# EAGLE design miniframeV2 (EAGLE 5.10)
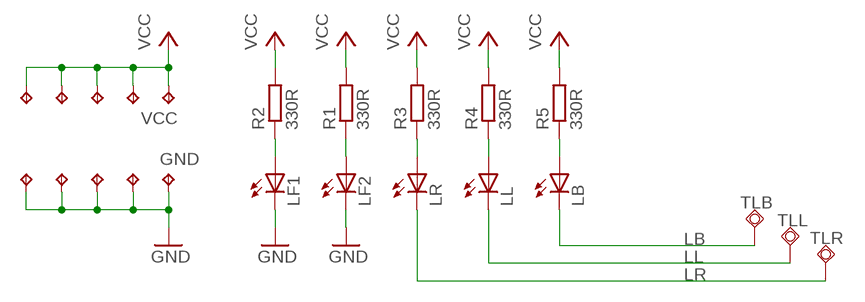
[diagram p0: schematic, sheet 1]

## Parts
GND  TPTP20SQ  [TP20SQ]
GND4  TPTP20SQ  [TP20SQ]
GND5  TPTP20SQ  [TP20SQ]
GND6  TPTP20SQ  [TP20SQ]
GND7  TPTP20SQ  [TP20SQ]
LB  LEDCHIPLED_1206  [CHIPLED_1206]
LF1  LEDCHIPLED_1206  [CHIPLED_1206]
LF2  LEDCHIPLED_1206  [CHIPLED_1206]
LL  LEDCHIPLED_1206  [CHIPLED_1206]
LR  LEDCHIPLED_1206  [CHIPLED_1206]
R1  330R  R-EU_R0805  [R0805]
R2  330R  R-EU_R0805  [R0805]
R3  330R  R-EU_R0805  [R0805]
R4  330R  R-EU_R0805  [R0805]
R5  330R  R-EU_R0805  [R0805]
TLB  TPSQTP19R  [TP19R]
TLL  TPSQTP19R  [TP19R]
TLR  TPSQTP19R  [TP19R]
VCC  TPTP20SQ  [TP20SQ]
VCC1  TPTP20SQ  [TP20SQ]
VCC2  TPTP20SQ  [TP20SQ]
VCC3  TPTP20SQ  [TP20SQ]
VCC4  TPTP20SQ  [TP20SQ]

## Nets
GND: GND4.TP GND5.TP GND6.TP GND7.TP GND.TP LF1.C LF2.C
LB: LB.C TLB.TP
LL: LL.C TLL.TP
LR: LR.C TLR.TP
N$1: LF1.A R2.1
N$2: LF2.A R1.1
N$3: LR.A R3.1
N$4: LL.A R4.1
N$5: LB.A R5.1
VCC: R1.2 R2.2 R3.2 R4.2 R5.2 VCC1.TP VCC2.TP VCC3.TP VCC4.TP VCC.TP

## Library data of the parts
GND GND4-GND7 VCC VCC1-VCC4 = testpad:TP: Test pad
LB LF1 LF2 LL LR = led:LED: LED OSRAM: - CHIPLED LG R971, LG N971, LY N971, LG Q971, LY Q971, LO R971, LY R971 LH N974, LH R974 LS Q976, LO Q976, LY Q976 LO Q996 - Hyper CHIPLED LW Q18S LB Q993, LB Q99A, LB R99A - SideLED LS A670, LO A670, LY A670, LG A670, LP A670 LB A673, LV A673, LT A673, LW A673 LH A674 LY A675 LS A676, LA A676, LO A676, LY A676, LW A676 LS A679, LY A679, LG A679 - Hyper Micro SIDELED® LS Y876, LA Y876, LO Y876, LY Y876 LT Y87S - SmartLED LW L88C, LW L88S LB L89C, LB L89S, LG L890 LS L89K, LO L89K, LY L89K LS L896, LA L896, LO L896, LY L896 - TOPLED LS T670, LO T670, LY T670, LG T670, LP T670 LSG T670, LSP T670, LSY T670, LOP T670, LYG T670 LG T671, LOG T671, LSG T671 LB T673, LV T673, LT T673, LW T673 LH T674 LS T676, LA T676, LO T676, LY T676, LB T676, LH T676, LSB T676, LW T676 LB T67C, LV T67C, LT T67C, LS T67K, LO T67K, LY T67K, LW E67C LS E67B, LA E67B, LO E67B, LY E67B, LB E67C, LV E67C, LT E67C LW T67C LS T679, LY T679, LG T679 LS T770, LO T770, LY T770, LG T770, LP T770 LB T773, LV T773, LT T773, LW T773 LH T774 LS E675, LA E675, LY E675, LS T675 LS T776, LA T776, LO T776, LY T776, LB T776 LHGB T686 LT T68C, LB T68C - Hyper Mini TOPLED® LB M676 - Mini TOPLED Santana® LG M470 LS M47K, LO M47K, LY M47K Source: http://www.osram.convergy.de LUXEON: - LUMILED® LXK2-PW12-R00, LXK2-PW12-S00, LXK2-PW14-U00, LXK2-PW14-V00 LXK2-PM12-R00, LXK2-PM12-S00, LXK2-PM14-U00 LXK2-PE12-Q00, LXK2-PE12-R00, LXK2-PE12-S00, LXK2-PE14-T00, LXK2-PE14-U00 LXK2-PB12-K00, LXK2-PB12-L00, LXK2-PB12-M00, LXK2-PB14-N00, LXK2-PB14-P00, LXK2-PB14-Q00 LXK2-PR12-L00, LXK2-PR12-M00, LXK2-PR14-Q00, LXK2-PR14-R00 LXK2-PD12-Q00, LXK2-PD12-R00, LXK2-PD12-S00 LXK2-PH12-R00, LXK2-PH12-S00 LXK2-PL12-P00, LXK2-PL12-Q00, LXK2-PL12-R00 Source: www.luxeon.com KINGBRIGHT: KA-3528ASYC Source: www.kingbright.com
R1-R5 = rcl:R-EU_: RESISTOR, European symbol
TLB TLL TLR = testpad:TPSQ: Test pad

## Board
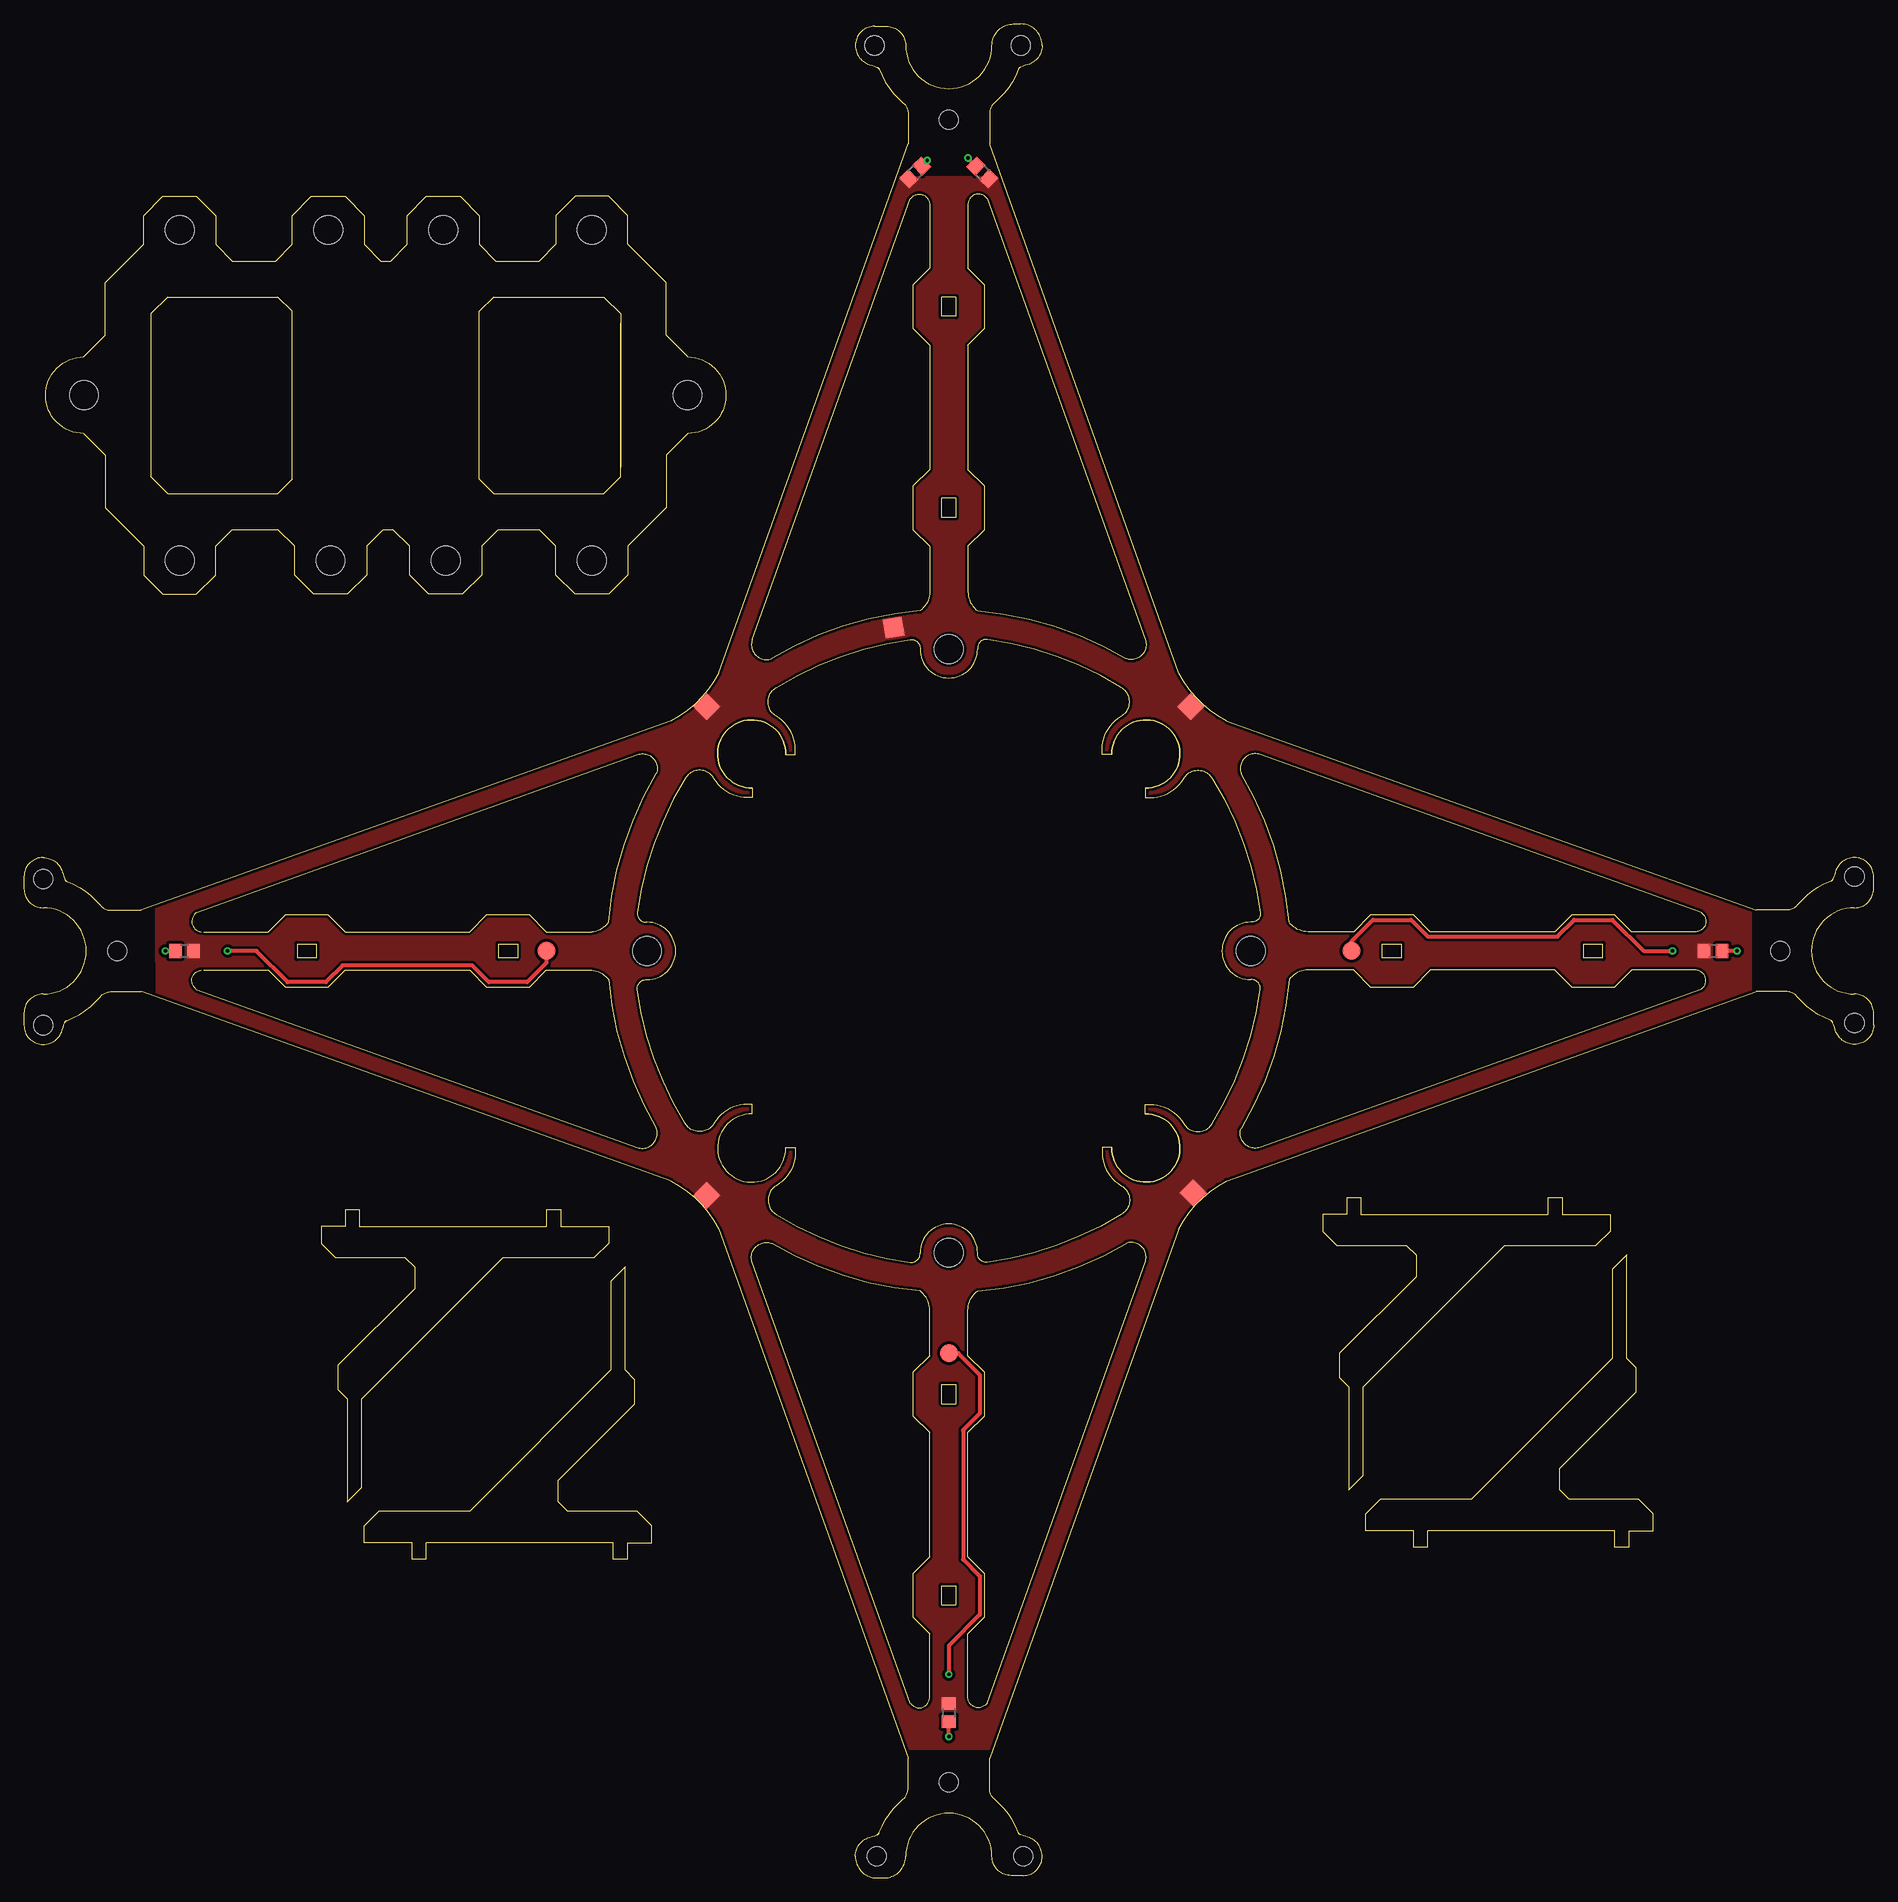
[diagram p1: board, top side]
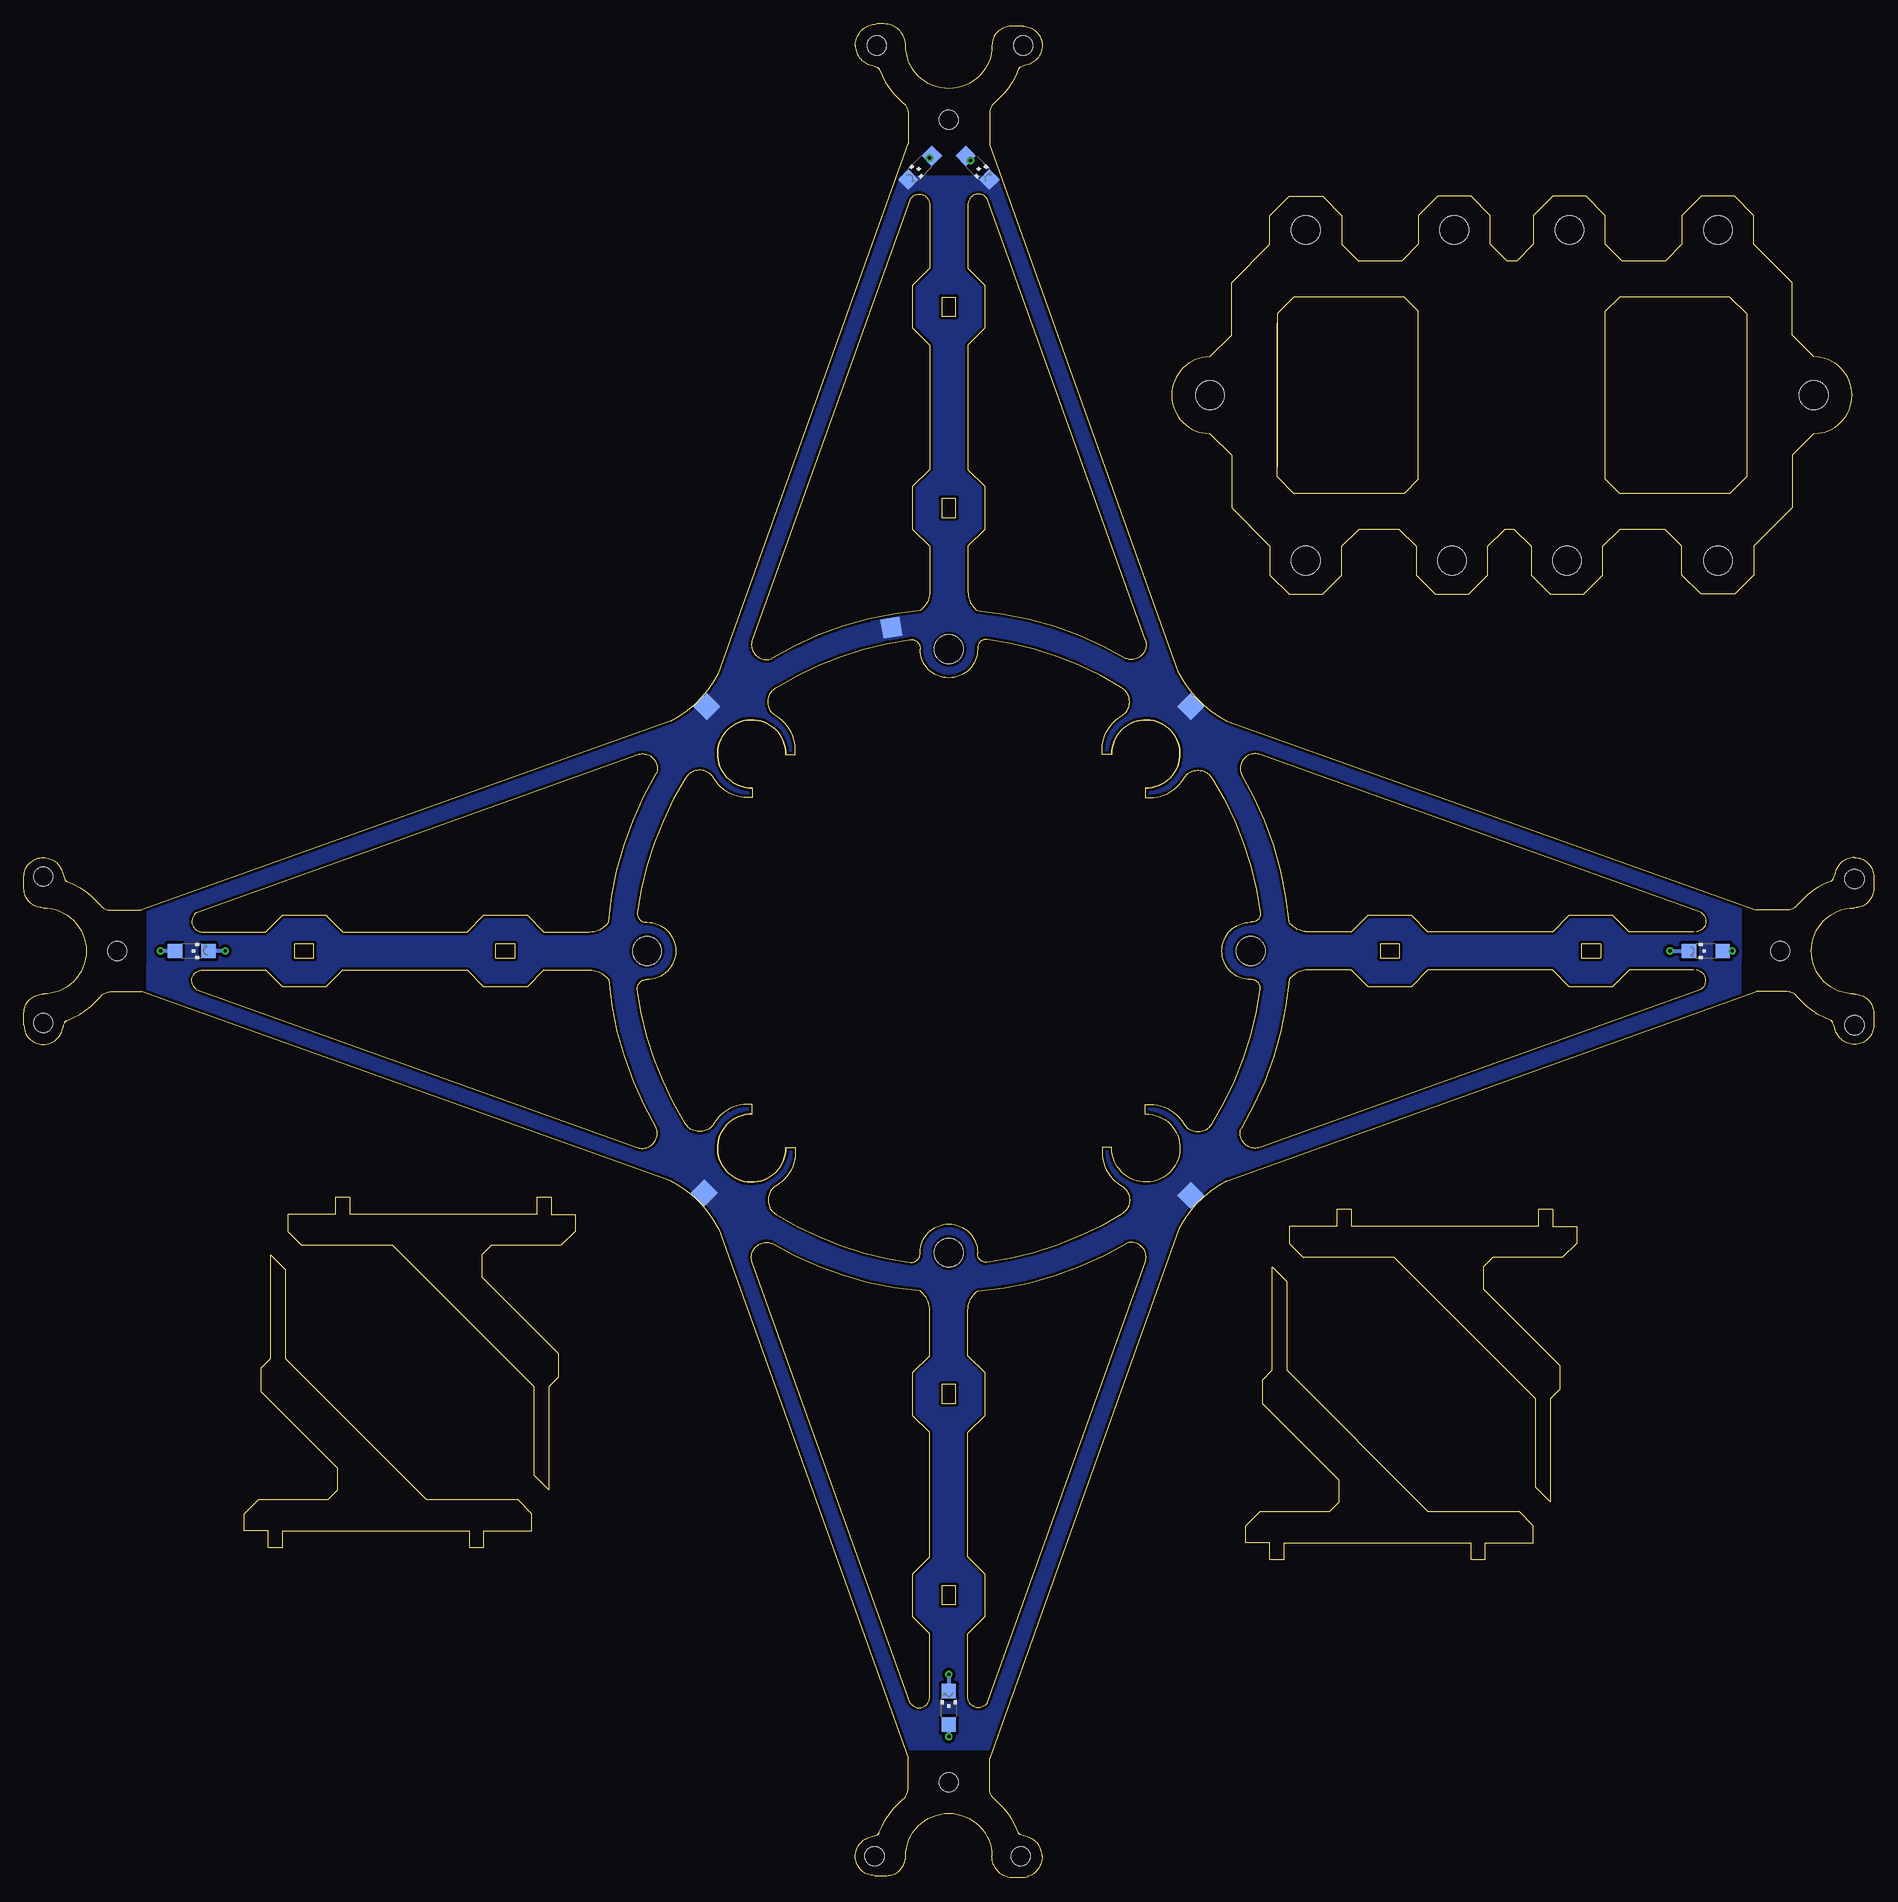
[diagram p2: board, bottom side, seen from below]

Size 193 x 193.5 mm. Coordinates in mm from the lower left corner, seen from the top.
Outline: 76,113.75 arc-272 79.5,117.25
Outline: 18.5,98.75 arc-141 18,100.75 64,117.25 arc-129 66,115.25 arc26 61,99.75 arc-53 59,98.75
Outline: 76,113.75 76,112.75 75.5,112.75 arc-59 72,114.75 arc119 69,114.75 arc24 64,100.75 arc103 65,99.75 arc-180 65,93.75 arc103 64,92.75 arc24 69,78.75 arc119 72,78.75 arc-59 75.5,80.75 76,80.75 76,79.75 arc272 79.5,76.25 80.5,76.25 80.5,75.75 arc-59 78.5,72.25 arc119 78.5,69.25 arc24 92.5,64.25 arc103 93.5,65.25 arc-180 99.5,65.25 arc103 100.5,64.25 arc24 114.5,69.25 arc119 114.5,72.25 arc-59 112.5,75.75 112.5,76.25 113.5,76.25
Outline: 18.5,94.75 arc141 18,92.75 64,76.25 arc129 66,78.25 arc-26 61,93.75 arc53 59,94.75
Outline: 2,87 arc-90 0,89 0,90.25 arc-90 2,92.25 arc180 2,101.25 arc-90 0,103.25 0,104.5 arc-90 2,106.5 arc-74 4,105 arc4 4.25,104.25 arc49 4.5,104 arc-30 8,101.5 arc48 9,101 12.25,101 67.5,120.75 arc36 72.5,125.75 92.25,181 92.25,184.25 arc48 91.75,185.25 arc-30 89.25,188.75 arc49 89,189 arc4 88.25,189.25
Outline: 2,87 arc74 4,88.5
Outline: 113.5,76.25 arc272 117,79.75
Outline: 117,79.75 arc-272 113.5,76.25
Outline: 117,79.75 117,80.75 117.5,80.75 arc-59 121,78.75 arc119 124,78.75 arc24 129,92.75 arc103 128,93.75 arc-180 128,99.75 arc103 129,100.75 arc24 124,114.75 arc119 121,114.75 arc-59 117.5,112.75 117,112.75 117,113.75
Outline: 117,113.75 arc272 113.5,117.25
Outline: 113.5,117.25 arc-272 117,113.75
Outline: 113.5,117.25 112.5,117.25 112.5,117.75 arc-59 114.5,121.25 arc119 114.5,124.25 arc24 100.5,129.25 arc103 99.5,128.25 arc-180 93.5,128.25 arc103 92.5,129.25 arc24 78.5,124.25 arc119 78.5,121.25 arc-59 80.5,117.75 80.5,117.25 79.5,117.25
Outline: 79.5,117.25 arc272 76,113.75
Outline: 191,87 arc90 193,89 193,90.25 arc90 191,92.25 arc-180 191,101.25 arc90 193,103.25 193,104.5 arc90 191,106.5 arc74 189,105 arc-4 188.75,104.25 arc-49 188.5,104 arc30 185,101.5 arc-48 184,101 180.75,101 125.5,120.75 arc-36 120.5,125.75 100.75,181 100.75,184.25 arc-48 101.25,185.25 arc30 103.75,188.75 arc-49 104,189 arc-4 104.75,189.25 arc74 106.25,191.25 arc90 104,193.5 103.25,193.5 arc90 101,191.25 arc-180 92,191.25 arc90 90,193.25 88.75,193.25 arc90 86.75,191.25
Outline: 191,87 arc-74 189,88.5
Outline: 106.25,2.25 arc-90 104.25,0.25 103,0.25 arc-90 101,2.25 arc180 92,2.25 arc-90 89.75,0 89,0 arc-90 86.75,2.25 arc-74 88.25,4.25 arc4 89,4.5 arc49 89.25,4.75 arc-30 91.75,8.25 arc48 92.25,9.25 92.25,12.5 72.5,67.75 arc36 67.5,72.75 12.25,92.5 9,92.5 arc48 8,92 arc-30 4.5,89.5 arc49 4.25,89.25 arc4 4,88.5
Outline: 106.25,2.25 arc74 104.75,4.25
Outline: 86.75,191.25 arc74 88.25,189.25
Outline: 18.75,98.75 25.5,98.75 27.25,100.5 31.75,100.5 33.5,98.75 46.5,98.75 48.25,100.5 52.75,100.5 54.5,98.75 59.25,98.75
Outline: 18.75,94.75 25.5,94.75 27.25,93 31.75,93 33.5,94.75 46.5,94.75 48.25,93 52.75,93 54.5,94.75 59.25,94.75
Outline: 86.75,191.25 arc74 88.25,189.25
Outline: 2,87 arc74 4,88.5
Outline: 106.25,2.25 arc74 104.75,4.25
Outline: 104.75,4.25 arc-4 104,4.5 arc-49 103.75,4.75 arc30 101.25,8.25 arc-48 100.75,9.25 100.75,12.5 120.5,67.75 arc-36 125.5,72.75 180.75,92.5 184,92.5 arc-48 185,92 arc30 188.5,89.5 arc-49 188.75,89.25 arc-4 189,88.5
Outline: 191,87 arc-74 189,88.5
Outline: 62.25,162.25 62.25,146.25 60.5,144.5 49,144.5 47.5,146 47.5,163.5 49,165 60.5,165 62.25,163.25 62.25,147.25
Outline: 92.5,18.25 76,64.25 arc-129 78,66.25 arc26 93.5,61.25 arc-53 94.5,59.25 94.5,54.5 92.75,52.75 92.75,48.25 94.5,46.5 94.5,33.5 92.75,31.75 92.75,27.25 94.5,25.5 94.5,18.75 arc-141 92.5,18.25
Outline: 100.5,18.25 117,64.25 arc129 115,66.25 arc-26 99.5,61.25 arc53 98.5,59.25 98.5,54.5 100.25,52.75 100.25,48.25 98.5,46.5 98.5,33.5 100.25,31.75 100.25,27.25 98.5,25.5 98.5,18.75 arc141 100.5,18.25
Outline: 175,92.75 129,76.25 arc-129 127,78.25 arc26 132,93.75 arc-53 134,94.75 138.75,94.75 140.5,93 145,93 146.75,94.75 159.75,94.75 161.5,93 166,93 167.75,94.75 174.5,94.75 arc-141 175,92.75
Outline: 175,100.75 129,117.25 arc129 127,115.25 arc-26 132,99.75 arc53 134,98.75 138.75,98.75 140.5,100.5 145,100.5 146.75,98.75 159.75,98.75 161.5,100.5 166,100.5 167.75,98.75 174.5,98.75 arc141 175,100.75
Outline: 100.5,175.25 117,129.25 arc-129 115,127.25 arc26 99.5,132.25 arc-53 98.5,134.25 98.5,139 100.25,140.75 100.25,145.25 98.5,147 98.5,160 100.25,161.75 100.25,166.25 98.5,168 98.5,174.75 arc-141 100.5,175.25
Outline: 92.5,175.25 arc-141 94.5,174.75 94.5,168 92.75,166.25 92.75,161.75 94.5,160 94.5,147 92.75,145.25 92.75,140.75 94.5,139 94.5,134.25 arc-53 93.5,132.25 arc26 78,127.25 arc-129 76,129.25 92.5,175.25
Outline: 28.5,97.5 28.5,96 30.5,96 30.5,97.5 28.5,97.5
Outline: 49.5,97.5 49.5,96 51.5,96 51.5,97.5 49.5,97.5
Outline: 95.75,28.5 97.25,28.5 97.25,30.5 95.75,30.5 95.75,28.5
Outline: 95.75,49.5 97.25,49.5 97.25,51.5 95.75,51.5 95.75,49.5
Outline: 164.75,96 164.75,97.5 162.75,97.5 162.75,96 164.75,96
Outline: 143.75,96 143.75,97.5 141.75,97.5 141.75,96 143.75,96
Outline: 97.25,165 95.75,165 95.75,163 97.25,163 97.25,165
Outline: 97.25,144 95.75,144 95.75,142 97.25,142 97.25,144
Outline: 33.5,69.75 35,69.75 35,68 54.5,68 54.5,69.75 56,69.75 56,68 61,68 61,66.25 59.5,64.75 50,64.75 35.25,50 35.25,40.75 33.75,39.25 33.75,50 32.75,51 32.75,53.5 40.75,61.5 40.75,63.75 39.75,64.75 32.5,64.75 31,66.25 31,68 33.5,68 33.5,69.75
Outline: 63,33.25 61.5,33.25 61.5,35 42,35 42,33.25 40.5,33.25 40.5,35 35.5,35 35.5,36.75 37,38.25 46.5,38.25 61.25,53 61.25,62.25 62.75,63.75 62.75,53 63.75,52 63.75,49.5 55.75,41.5 55.75,39.25 56.75,38.25 64,38.25 65.5,36.75 65.5,35 63,35 63,33.25
Outline: 138,71 139.5,71 139.5,69.25 159,69.25 159,71 160.5,71 160.5,69.25 165.5,69.25 165.5,67.5 164,66 154.5,66 139.75,51.25 139.75,42 138.25,40.5 138.25,51.25 137.25,52.25 137.25,54.75 145.25,62.75 145.25,65 144.25,66 137,66 135.5,67.5 135.5,69.25 138,69.25 138,71
Outline: 167.5,34.5 166,34.5 166,36.25 146.5,36.25 146.5,34.5 145,34.5 145,36.25 140,36.25 140,38 141.5,39.5 151,39.5 165.75,54.25 165.75,63.5 167.25,65 167.25,54.25 168.25,53.25 168.25,50.75 160.25,42.75 160.25,40.5 161.25,39.5 168.5,39.5 170,38 170,36.25 167.5,36.25 167.5,34.5
Outline: 6.25,150.75 8.5,148.5 8.5,143 12.5,139 12.5,136 14.5,134 18,134 20,136 20,139 21.75,140.75 26.5,140.75 28.25,139 28.25,136 30.25,134 33.75,134 35.75,136 35.75,139 37.5,140.75 38.5,140.75 40.25,139 40.25,136 42.25,134 45.75,134 47.75,136 47.75,139 49.5,140.75 53.75,140.75 55.5,139 55.5,136 57.5,134 61,134 63,136 63,139 67,143 67,148.5 69.25,150.75 arc180 69.25,158.75 67,161 67,166.5 63,170.5 63,173.5 61,175.5 57.5,175.5 55.5,173.5 55.5,170.5 53.75,168.75 49.25,168.75 47.5,170.5 47.5,173.5 45.5,175.5 42,175.5 40,173.5 40,170.5 38.25,168.75 37.25,168.75 35.5,170.5 35.5,173.5 33.5,175.5 30,175.5 28,173.5 28,170.5 26.25,168.75 21.75,168.75 20,170.5 20,173.5 18,175.5 14.5,175.5 12.5,173.5 12.5,170.5 8.5,166.5 8.5,161 6.25,158.75 arc180 6.25,150.75
Outline: 15,165 13.25,163.25 13.25,146.25 15,144.5 26.5,144.5 28,146 28,163.5 26.5,165 15,165
Copper layers (1*16): Top 0.035mm / dielectric 1.5mm / Bottom 0.035mm
Design rules "default *": minimum track width 10mil, minimum drill 24mil, track to track 8mil, track to pad 8mil, pad to pad 8mil, via to via 8mil, smd to smd 8mil, copper to edge 1mil, drill to drill 8mil, minimum pad ring 10mil, minimum via ring 8mil, stop-mask expansion 4mil, vias tented up to drill 0mil, thermal gap 10mil
Holes 3 mm at 65,96.75 96.5,65.25 128,96.75 96.5,128.25 6.25,154.75 69.25,154.75 16.25,172 59.25,172 16.25,137.5 59.25,137.5 31.75,172 43.75,172 44,137.5 32,137.5
Holes 2 mm at 2,104.25 9.75,96.75 2,89 89,2.25 96.5,10 104.25,2.25 191,89.25 183.25,96.75 191,104.5 88.75,191.25 96.5,183.5 104,191.25

### Footprints (pad centres in the part's own frame; a part is rotated, then mirrored left to right if it is on the bottom)
TP20SQ = smd 2 x 2: TP 0,0
CHIPLED_1206 = smd 1.5 x 1.5: A 0,-1.75; C 0,1.75
R0805 = smd 1.3 x 1.5: 1 -0.95,0; 2 0.95,0
TP19R = smd 1.9 x 1.9: TP 0,0

### Placement (x,y rotation side)
GND  102.5,130.5 10 bottom
GND4  71.25,71.25 45 bottom
GND5  122,71.5 45 bottom
GND6  121.75,122.25 45 bottom
GND7  71.25,122.25 45 bottom
LB  96.5,17.75 0 bottom
LF1  93.5,178.5 225 bottom
LF2  99.5,178.5 135 bottom
LL  175.5,96.75 270 bottom
LR  17.5,96.75 90 bottom
R1  100,178 315 top
R2  93,178 225 top
R3  16.75,96.75 0 top
R4  176.25,96.75 180 top
R5  96.5,17.25 90 top
TLB  96.5,54.75 0 top
TLL  138.5,96.75 0 top
TLR  54.5,96.75 0 top
VCC  90.75,130.5 100 top
VCC1  71.25,71.25 45 top
VCC2  122,71.5 45 top
VCC3  121.75,122.25 45 top
VCC4  71.25,122.25 45 top

### Tracks (layer width: path | path; a pad name or v marks a point on that pad's centre or on a via)
GND
  pour Bottom (isolate 0.3, no thermals): 13.75,177.5 180,177.5 180.25,13.5 14,13.5
LB  (via drill 0.36)
  Top 0.406: v96.5,21.25 96.5,24.25 99.75,27.5 99.75,31.5 98,33.25 98,46.75 99.75,48.5 99.75,52.5 97.5,54.75 TLB.TP
  Bottom 0.406: v96.5,21.25 LB.C
LL  (via drill 0.36)
  Top 0.406: v172,96.75 169,96.75 165.75,100 161.75,100 160,98.25 146.5,98.25 144.75,100 140.75,100 138.5,97.75 TLL.TP
  Bottom 0.406: v172,96.75 LL.C
LR  (via drill 0.36)
  Top 0.406: v21.25,96.75 24.25,96.75 27.5,93.5 31.5,93.5 33.25,95.25 46.75,95.25 48.5,93.5 52.5,93.5 54.5,95.5 TLR.TP
  Bottom 0.406: v21.25,96.75 LR.C
N$1  (via drill 0.36)
  Top 0.406: R2.1 v94.25,179.25 | v94.25,179.25
  Bottom 0.406: v94.25,179.25 LF1.A
N$2  (via drill 0.36)
  Top 0.406: R1.1 v98.5,179.5 | v98.5,179.5
  Bottom 0.406: v98.5,179.5 LF2.A
N$3  (via drill 0.36)
  Top 0.406: v14.75,96.75 R3.1
  Bottom 0.406: LR.A v14.75,96.75
N$4  (via drill 0.36)
  Top 0.406: v178.75,96.75 R4.1
  Bottom 0.406: LL.A v178.75,96.75
N$5  (via drill 0.36)
  Top 0.406: v96.5,14.75 R5.1
  Bottom 0.406: LB.A v96.5,14.75
VCC
  pour Top (isolate 0.3, no thermals): 13.75,177.5 180,177.5 180.25,13.5 14,13.5